# EAGLE design tiny85_activity_led (EAGLE 9.2.2)
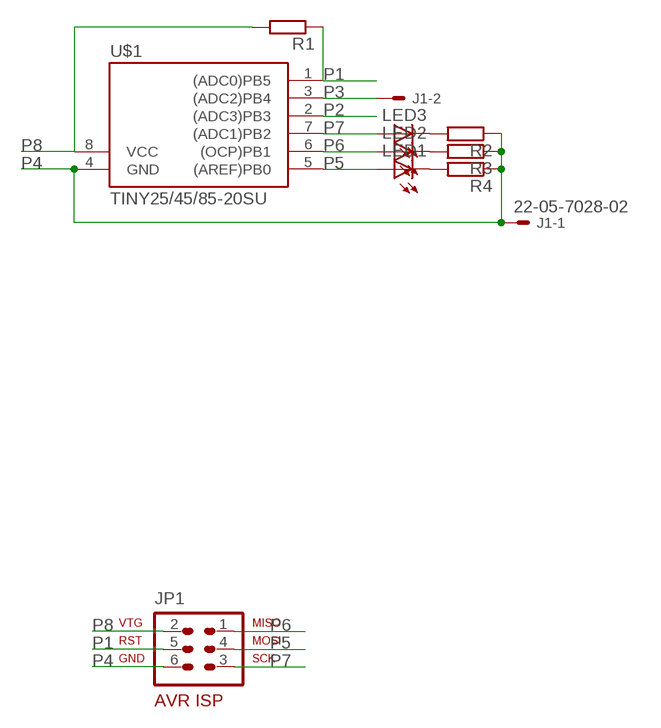
[diagram p0: schematic, sheet 1]

## Parts
J1  22-05-7028-02  [7395-02]
JP1  AVR-ISP-6R  [AVR-ISP-6R]
LED1  LED10MM  [LED10MM]
LED2  LED10MM  [LED10MM]
LED3  LED10MM  [LED10MM]
R1  R-EU_R0805  [R0805]
R2  R-EU_R0805  [R0805]
R3  R-EU_R0805  [R0805]
R4  R-EU_R0805  [R0805]
U$1  TINY25/45/85-20SU  [SOIC8]

## Nets
N$1: LED3.K(C) R2.2
N$2: LED2.K(C) R3.2
N$3: LED1.K(C) R4.2
P1: JP1.5 R1.1 U$1.1((ADC0)PB5)
P2: U$1.2((ADC3)PB3)
P3: J1.2 U$1.3((ADC2)PB4)
P4: J1.1 JP1.6 R2.1 R3.1 R4.1 U$1.4(GND)
P5: JP1.4 LED1.A U$1.5((AREF)PB0)
P6: JP1.1 LED2.A U$1.6((OCP)PB1)
P7: JP1.3 LED3.A U$1.7((ADC1)PB2)
P8: JP1.2 R1.2 U$1.8(VCC)

## Library data of the parts
J1 = con-molex:22-?-02: CONNECTOR wire to board 2.54 mm (.1 inch) pitch header; MF: MOLEX; OC_FARNELL: 9731601; OC_NEWARK: unknown
JP1 = avr-6:AVR-ISP-6: AVR ISP-6 Serial Programming Header
LED1-LED3 = led:LED: LED OSRAM: - CHIPLED LG R971, LG N971, LY N971, LG Q971, LY Q971, LO R971, LY R971 LH N974, LH R974 LS Q976, LO Q976, LY Q976 LO Q996 - Hyper CHIPLED LW Q18S LB Q993, LB Q99A, LB R99A - SideLED LS A670, LO A670, LY A670, LG A670, LP A670 LB A673, LV A673, LT A673, LW A673 LH A674 LY A675 LS A676, LA A676, LO A676, LY A676, LW A676 LS A679, LY A679, LG A679 - Hyper Micro SIDELED® LS Y876, LA Y876, LO Y876, LY Y876 LT Y87S - SmartLED LW L88C, LW L88S LB L89C, LB L89S, LG L890 LS L89K, LO L89K, LY L89K LS L896, LA L896, LO L896, LY L896 - TOPLED LS T670, LO T670, LY T670, LG T670, LP T670 LSG T670, LSP T670, LSY T670, LOP T670, LYG T670 LG T671, LOG T671, LSG T671 LB T673, LV T673, LT T673, LW T673 LH T674 LS T676, LA T676, LO T676, LY T676, LB T676, LH T676, LSB T676, LW T676 LB T67C, LV T67C, LT T67C, LS T67K, LO T67K, LY T67K, LW E67C LS E67B, LA E67B, LO E67B, LY E67B, LB E67C, LV E67C, LT E67C LW T67C LS T679, LY T679, LG T679 LS T770, LO T770, LY T770, LG T770, LP T770 LB T773, LV T773, LT T773, LW T773 LH T774 LS E675, LA E675, LY E675, LS T675 LS T776, LA T776, LO T776, LY T776, LB T776 LHGB T686 LT T68C, LB T68C - Hyper Mini TOPLED® LB M676 - Mini TOPLED Santana® LG M470 LS M47K, LO M47K, LY M47K Source: http://www.osram.convergy.de LUXEON: - LUMILED® LXK2-PW12-R00, LXK2-PW12-S00, LXK2-PW14-U00, LXK2-PW14-V00 LXK2-PM12-R00, LXK2-PM12-S00, LXK2-PM14-U00 LXK2-PE12-Q00, LXK2-PE12-R00, LXK2-PE12-S00, LXK2-PE14-T00, LXK2-PE14-U00 LXK2-PB12-K00, LXK2-PB12-L00, LXK2-PB12-M00, LXK2-PB14-N00, LXK2-PB14-P00, LXK2-PB14-Q00 LXK2-PR12-L00, LXK2-PR12-M00, LXK2-PR14-Q00, LXK2-PR14-R00 LXK2-PD12-Q00, LXK2-PD12-R00, LXK2-PD12-S00 LXK2-PH12-R00, LXK2-PH12-S00 LXK2-PL12-P00, LXK2-PL12-Q00, LXK2-PL12-R00 Source: www.luxeon.com KINGBRIGHT: KA-3528ASYC Source: www.kingbright.com
R1-R4 = resistor:R-EU_: RESISTOR, European symbol
U$1 = avr-6:TINY25/45/85

## Board
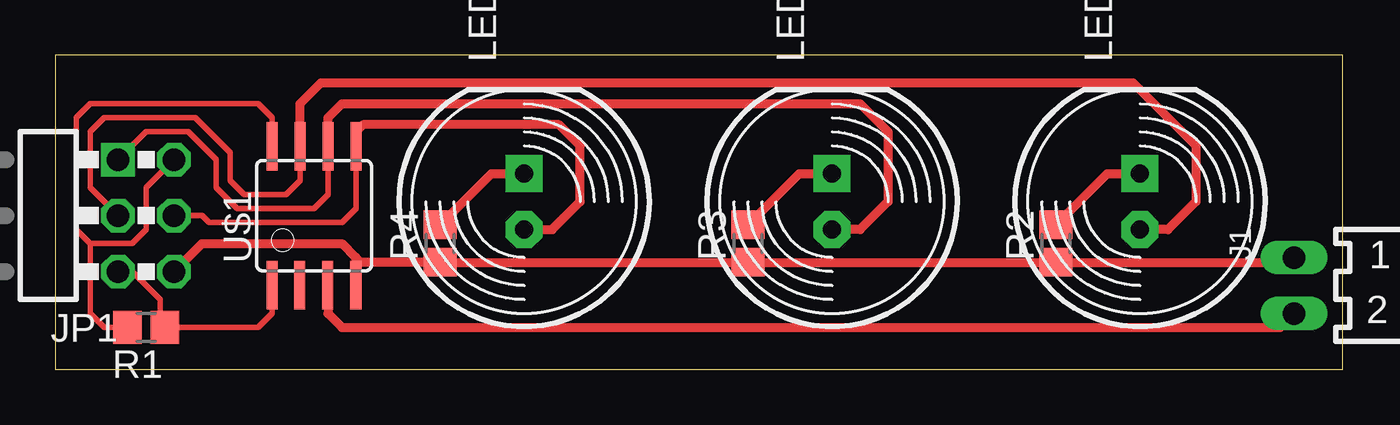
[diagram p1: board, top side]

Size 58.4 x 14.28 mm. Coordinates in mm from the lower left corner, seen from the top.
Outline: 0,0 58.4,0 58.4,14.28 0,14.28 0,0
Copper layers (1*16): Top 0.035mm / dielectric 1.5mm / Bottom 0.035mm
Design rules "default": minimum track width 10mil, minimum drill 24mil, track to track 8mil, track to pad 8mil, pad to pad 8mil, via to via 8mil, smd to smd 8mil, copper to edge 40mil, drill to drill 8mil, minimum pad ring 10mil, minimum via ring 8mil, stop-mask expansion 4mil, vias tented up to drill 0mil, thermal gap 10mil

### Footprints (pad centres in the part's own frame; a part is rotated, then mirrored left to right if it is on the bottom)
7395-02 = drill 1.016 long: 1 1.27,0; 2 -1.27,0
AVR-ISP-6R = drill 1.016 square: 1 -2.54,-1.27 | drill 1.016 octagon: 2 -2.54,1.27; 3 0,-1.27; 4 0,1.27; 5 2.54,-1.27; 6 2.54,1.27
LED10MM = drill 0.813 pad 1.676 octagon: A -1.27,0 | drill 0.813 pad 1.676 square: K 1.27,0
R0805 = smd 1.3 x 1.5: 1 -0.85,0; 2 0.85,0
SOIC8 = smd 0.5 x 2.2: 1 -1.905,-3.154; 2 -0.645,-3.154; 3 0.625,-3.154; 4 1.895,-3.154; 5 1.905,3.154; 6 0.635,3.154; 7 -0.635,3.154; 8 -1.905,3.154

### Placement (x,y rotation side)
J1  56.2,3.81 90 top
JP1  4.13,6.99 270 top
LED1  21.27,7.62 90 top
LED2  35.24,7.62 90 top
LED3  49.21,7.62 90 top
R1  4.13,1.91 180 top
R2  45.4,5.71 90 top
R3  31.43,5.71 90 top
R4  17.46,5.71 90 top
U$1  11.75,6.99 0 top

### Tracks (layer width: path | path; a pad name or v marks a point on that pad's centre or on a via)
N$1
  Top 0.406: R2.2 47.73,8.89 LED3.K
N$2
  Top 0.406: R3.2 33.76,8.89 LED2.K
N$3
  Top 0.406: LED1.K 19.79,8.89 R4.2
P1
  Top 0.254: U$1.1 9.84,2.54 9.21,1.91 R1.1 4.76,2.12 4.76,3.17 3.49,4.45 JP1.5
P2
  Top 0.254: U$1.2 11.11,3.82
P3
  Top 0.406: U$1.3 12.38,3.82 12.38,2.54 13.02,1.91 55.56,1.91 J1.2
P4
  Top 0.254: U$1.4 13.65,3.82
  Top 0.406: JP1.6 6.67,5.71 13.02,5.71 13.64,5.09 | 13.65,3.84 U$1.4 13.64,5.09 | 13.64,5.09 13.87,4.87 R4.1 R3.1 R2.1 55.98,4.87 J1.1
P5
  Top 0.254: JP1.4 6.67,6.99 6.99,6.67 13.02,6.67 13.65,7.3 U$1.5
  Top 0.406: LED1.A 22.54,6.35 23.81,7.62 23.81,10.16 22.86,11.11 13.97,11.11 13.65,10.79 U$1.5
P6
  Top 0.254: JP1.1 4.13,10.79 6.03,10.79 7.3,9.53 7.3,8.26 8.26,7.3 11.75,7.3 12.38,7.94 U$1.6
  Top 0.406: U$1.6 12.38,11.43 13.02,12.06 36.51,12.06 37.78,10.79 37.78,7.62 36.51,6.35 LED2.A
P7
  Top 0.254: JP1.3 1.59,8.26 1.59,10.79 2.22,11.43 6.35,11.43 7.94,9.84 7.94,8.57 8.57,7.94 10.48,7.94 11.11,8.57 U$1.7
  Top 0.406: U$1.7 11.11,12.06 12.06,13.02 48.9,13.02 51.75,10.16 51.75,7.62 50.48,6.35 LED3.A
P8
  Top 0.254: JP1.2 4.13,8.26 4.13,6.35 3.49,5.71 1.59,5.71 | 1.59,5.71 0.95,6.35 0.95,11.43 1.59,12.06 9.21,12.06 9.84,11.43 U$1.8 | R1.2 2.22,1.91 1.59,2.54 1.59,5.71